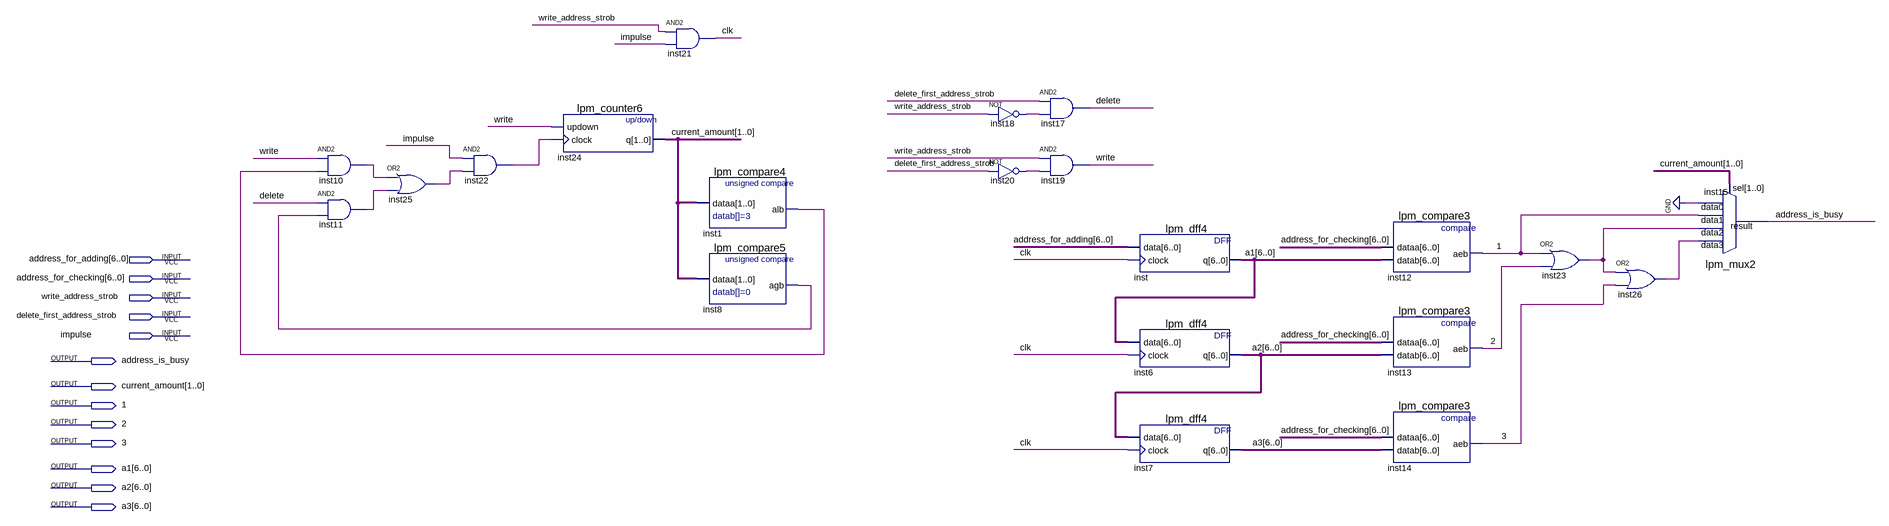
[diagram p0: schematic sheet]
// Quartus schematic BusyMemoryBlock.bdf as structural Verilog: 21 symbols, 13 pins
module BusyMemoryBlock (
  input  [6:0] address_for_adding,
  input  [6:0] address_for_checking,
  input  write_address_strob,
  input  delete_first_address_strob,
  input  impulse,
  output address_is_busy,
  output [1:0] current_amount,
  output \1 ,
  output \2 ,
  output \3 ,
  output [6:0] a1,
  output [6:0] a2,
  output [6:0] a3
);

  wire clk, delete, inst1_alb, inst8_agb, inst10_out, inst11_out, inst18_out, inst20_out, inst22_out,
       inst23_out, inst25_out, inst26_out, write;

  and inst10 (inst10_out, write, inst1_alb);
  and inst11 (inst11_out, delete, inst8_agb);
  or inst25 (inst25_out, inst10_out, inst11_out);
  and inst22 (inst22_out, impulse, inst25_out);
  lpm_counter6 inst24 (.updown(write), .clock(inst22_out), .q(current_amount));
  and inst21 (clk, write_address_strob, impulse);
  lpm_compare4 inst1 (.dataa(current_amount), .alb(inst1_alb));
  lpm_compare5 inst8 (.dataa(current_amount), .agb(inst8_agb));
  not inst18 (inst18_out, write_address_strob);
  not inst20 (inst20_out, delete_first_address_strob);
  and inst17 (delete, delete_first_address_strob, inst18_out);
  and inst19 (write, write_address_strob, inst20_out);
  lpm_dff4 inst (.data(address_for_adding), .clock(clk), .q(a1));
  lpm_dff4 inst6 (.data(a1), .clock(clk), .q(a2));
  lpm_dff4 inst7 (.data(a2), .clock(clk), .q(a3));
  lpm_compare3 inst12 (.dataa(address_for_checking), .datab(a1), .aeb(\1 ));
  lpm_compare3 inst13 (.dataa(address_for_checking), .datab(a2), .aeb(\2 ));
  lpm_compare3 inst14 (.dataa(address_for_checking), .datab(a3), .aeb(\3 ));
  or inst23 (inst23_out, \1 , \2 );
  or inst26 (inst26_out, inst23_out, \3 );
  lpm_mux2 inst15 (
    .data3(inst26_out), .data2(inst23_out), .data1(\1 ), .data0(1'b0), .sel(current_amount),
    .result(address_is_busy));
endmodule
